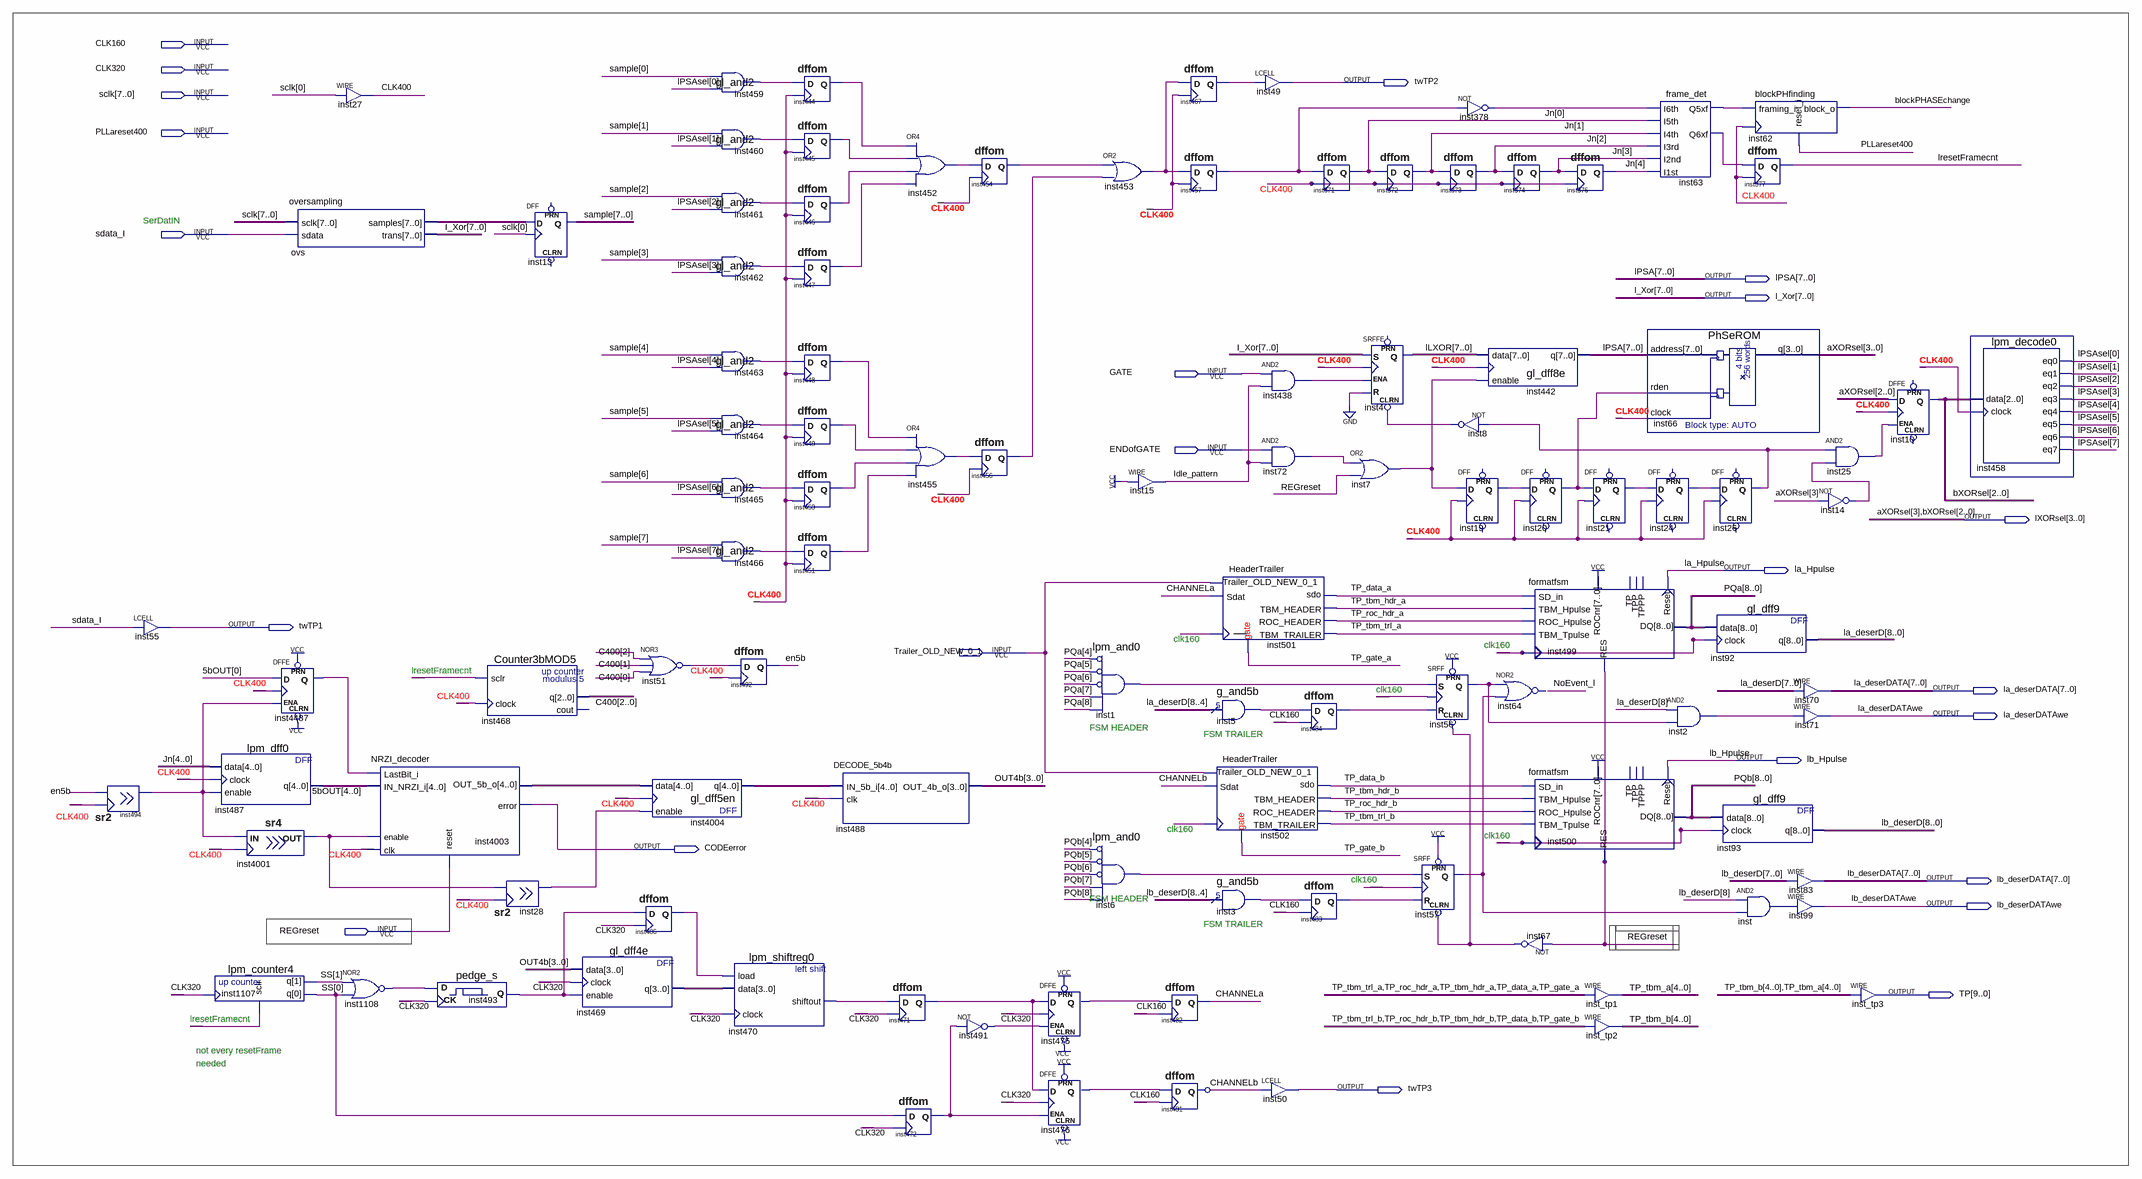
[diagram p0: schematic sheet]
// Quartus schematic deser400_PSI.bdf as structural Verilog: 104 symbols, 23 pins
module deser400_PSI (
  input  CLK160,
  input  CLK320,
  input  [7:0] sclk,
  input  PLLareset400,
  input  sdata_I,
  input  GATE,
  input  ENDofGATE,
  input  Trailer_OLD_NEW_0_1,
  input  REGreset,
  output twTP2,
  output [7:0] lPSA,
  output [7:0] l_Xor,
  output [3:0] lXORsel,
  output la_Hpulse,
  output twTP1,
  output [7:0] la_deserDATA,
  output la_deserDATAwe,
  output lb_Hpulse,
  output CODEerror,
  output [7:0] lb_deserDATA,
  output lb_deserDATAwe,
  output [9:0] TP,
  output twTP3
);

  wire blockPHASEchange, CHANNELa, CHANNELb, CLK400, en5b, Idle_pattern, inst1_result, inst2_out,
       inst3_result, inst5_result, inst6_result, inst7_out, inst8_out, inst14_out, inst19_q, inst20_q,
       inst21_q, inst24_q, inst25_out, inst26_q, inst28_out, inst51_out, inst56_q, inst57_q, inst63_q5xf,
       inst63_q6xf, inst67_out, inst72_out, inst378_out, inst438_out, inst444_q, inst445_q, inst446_q,
       inst447_q, inst448_q, inst449_q, inst450_q, inst451_q, inst452_out, inst453_out, inst454_q,
       inst455_out, inst456_q, inst457_q, inst459_result, inst460_result, inst461_result, inst462_result,
       inst463_result, inst464_result, inst465_result, inst466_result, inst467_q, inst470_shiftout,
       inst471_q, inst472_q, inst475_q, inst476_q, inst481_q, inst483_q, inst484_q, inst486_q, inst491_out,
       inst493_q, inst494_out, inst1108_out, inst4001_out, inst4487_q, inst_out, lresetFramecnt, TP_data_a,
       TP_data_b, TP_gate_a, TP_gate_b, TP_roc_hdr_a, TP_roc_hdr_b, TP_tbm_hdr_a, TP_tbm_hdr_b, TP_tbm_trl_a,
       TP_tbm_trl_b;
  wire [1:0] SS;
  wire [2:0] aXORsel, C400;
  wire [3:0] inst469_q, OUT4b;
  wire [4:0] \5bOUT , inst4003_out_5b_o, inst4004_q, Jn, TP_tbm_a, TP_tbm_b;
  wire [7:0] I_Xor, lLXOR, lPSAsel, ovs_samples, sample;
  wire [8:0] la_deserD, lb_deserD, PQa, PQb;

  sr2 inst494 (.CLK(CLK400), .IN(en5b), .OUT(inst494_out));
  LCELL inst55 (.IN(sdata_I), .OUT(twTP1));
  lpm_dff0 inst487 (.data(Jn), .clock(CLK400), .enable(inst494_out), .q(\5bOUT ));
  sr4 inst4001 (.IN(inst494_out), .CLK(CLK400), .OUT(inst4001_out));
  lpm_counter4 inst1107 (.sclr(lresetFramecnt), .clock(CLK320), .q(SS));
  oversampling ovs (.sclk(sclk), .sdata(sdata_I), .samples(ovs_samples), .trans(I_Xor));
  DFFE inst4487 (.PRN(1'b1), .CLRN(1'b1), .D(\5bOUT [0]), .CLK(CLK400), .ENA(inst494_out), .Q(inst4487_q));
  assign CLK400 = sclk[0];  // WIRE inst27
  nor inst1108 (inst1108_out, SS[1], SS[0]);
  NRZI_decoder inst4003 (
    .clk(CLK400), .reset(REGreset), .enable(inst4001_out), .IN_NRZI_i(\5bOUT ), .LastBit_i(inst4487_q),
    .OUT_5b_o(inst4003_out_5b_o), .error(CODEerror));
  pedge_s inst493 (.D(inst1108_out), .CK(CLK320), .Q(inst493_q));
  Counter3bMOD5 inst468 (.sclr(lresetFramecnt), .clock(CLK400), .q(C400));  // open: cout
  sr2 inst28 (.CLK(CLK400), .IN(inst4001_out), .OUT(inst28_out));
  DFF inst13[7:0] (.CLK(sclk[0]), .D(ovs_samples), .Q(sample));  // open: CLRN, PRN
  gl_dff4e inst469 (.data(OUT4b), .clock(CLK320), .enable(inst493_q), .q(inst469_q));
  nor inst51 (inst51_out, C400[2], C400[1], C400[0]);
  gl_dff5en inst4004 (.data(inst4003_out_5b_o), .enable(inst28_out), .clock(CLK400), .q(inst4004_q));
  dffom inst486 (.D(inst493_q), .CK(CLK320), .Q(inst486_q));
  gl_and2 inst459 (.data0(sample[0]), .data1(lPSAsel[0]), .result(inst459_result));
  gl_and2 inst460 (.data0(sample[1]), .data1(lPSAsel[1]), .result(inst460_result));
  gl_and2 inst461 (.data0(sample[2]), .data1(lPSAsel[2]), .result(inst461_result));
  gl_and2 inst462 (.data0(sample[3]), .data1(lPSAsel[3]), .result(inst462_result));
  gl_and2 inst463 (.data0(sample[4]), .data1(lPSAsel[4]), .result(inst463_result));
  gl_and2 inst464 (.data0(sample[5]), .data1(lPSAsel[5]), .result(inst464_result));
  gl_and2 inst465 (.data0(sample[6]), .data1(lPSAsel[6]), .result(inst465_result));
  gl_and2 inst466 (.data0(sample[7]), .data1(lPSAsel[7]), .result(inst466_result));
  dffom inst492 (.D(inst51_out), .CK(CLK400), .Q(en5b));
  lpm_shiftreg0 inst470 (.load(inst486_q), .data(inst469_q), .clock(CLK320), .shiftout(inst470_shiftout));
  dffom inst444 (.D(inst459_result), .CK(CLK400), .Q(inst444_q));
  dffom inst445 (.D(inst460_result), .CK(CLK400), .Q(inst445_q));
  dffom inst446 (.D(inst461_result), .CK(CLK400), .Q(inst446_q));
  dffom inst447 (.D(inst462_result), .CK(CLK400), .Q(inst447_q));
  dffom inst448 (.D(inst463_result), .CK(CLK400), .Q(inst448_q));
  dffom inst449 (.D(inst464_result), .CK(CLK400), .Q(inst449_q));
  dffom inst450 (.D(inst465_result), .CK(CLK400), .Q(inst450_q));
  dffom inst451 (.D(inst466_result), .CK(CLK400), .Q(inst451_q));
  DECODE_5b4b inst488 (.IN_5b_i(inst4004_q), .clk(CLK400), .OUT_4b_o(OUT4b));
  or inst452 (inst452_out, inst444_q, inst445_q, inst446_q, inst447_q);
  or inst455 (inst455_out, inst448_q, inst449_q, inst450_q, inst451_q);
  dffom inst471 (.D(inst470_shiftout), .CK(CLK320), .Q(inst471_q));
  dffom inst472 (.D(SS[0]), .CK(CLK320), .Q(inst472_q));
  not inst491 (inst491_out, inst472_q);
  dffom inst454 (.D(inst452_out), .CK(CLK400), .Q(inst454_q));
  dffom inst456 (.D(inst455_out), .CK(CLK400), .Q(inst456_q));
  DFFE inst475 (.PRN(1'b1), .CLRN(1'b1), .D(inst471_q), .CLK(CLK320), .ENA(inst491_out), .Q(inst475_q));
  DFFE inst476 (.PRN(1'b1), .CLRN(1'b1), .D(inst471_q), .CLK(CLK320), .ENA(inst472_q), .Q(inst476_q));
  or inst453 (inst453_out, inst454_q, inst456_q);
  lpm_and0 inst1 (
    .data0(~PQa[4]), .data1(~PQa[5]), .data2(~PQa[6]), .data3(PQa[7]), .data4(PQa[8]), .result(inst1_result));
  lpm_and0 inst6 (
    .data0(~PQb[4]), .data1(~PQb[5]), .data2(~PQb[6]), .data3(PQb[7]), .data4(PQb[8]), .result(inst6_result));
  assign Idle_pattern = 1'b1;  // WIRE inst15
  dffom inst482 (.D(inst475_q), .CK(CLK160), .Q(CHANNELa));
  dffom inst481 (.D(inst476_q), .CK(CLK160), .Q(inst481_q));
  not inst481_Q_inverted (CHANNELb, inst481_q);
  dffom inst467 (.D(inst453_out), .CK(CLK400), .Q(inst467_q));
  dffom inst457 (.D(inst453_out), .CK(CLK400), .Q(inst457_q));
  HeaderTrailer inst501 (
    .Sdat(CHANNELa), .CLK(CLK160), .Trailer_OLD_NEW_0_1(Trailer_OLD_NEW_0_1), .TBM_HEADER(TP_tbm_hdr_a),
    .ROC_HEADER(TP_roc_hdr_a), .TBM_TRAILER(TP_tbm_trl_a), .sdo(TP_data_a), .gate(TP_gate_a));
  g_and5b inst5 (.data(la_deserD[8:4]), .result(inst5_result));
  HeaderTrailer inst502 (
    .Sdat(CHANNELb), .CLK(CLK160), .Trailer_OLD_NEW_0_1(Trailer_OLD_NEW_0_1), .TBM_HEADER(TP_tbm_hdr_b),
    .ROC_HEADER(TP_roc_hdr_b), .TBM_TRAILER(TP_tbm_trl_b), .sdo(TP_data_b), .gate(TP_gate_b));
  g_and5b inst3 (.data(lb_deserD[8:4]), .result(inst3_result));
  LCELL inst49 (.IN(inst467_q), .OUT(twTP2));
  and inst438 (inst438_out, GATE, Idle_pattern);
  and inst72 (inst72_out, ENDofGATE, Idle_pattern);
  LCELL inst50 (.IN(CHANNELb), .OUT(twTP3));
  dffom inst371 (.D(inst457_q), .CK(CLK400), .Q(Jn[0]));
  dffom inst484 (.D(inst5_result), .CK(CLK160), .Q(inst484_q));
  dffom inst483 (.D(inst3_result), .CK(CLK160), .Q(inst483_q));
  SRFFE inst4[7:0] (.S(I_Xor), .CLK(CLK400), .CLRN(inst8_out), .R(1'b0), .ENA(inst438_out), .Q(lLXOR));  // open: PRN
  or inst7 (inst7_out, inst72_out, REGreset);
  dffom inst372 (.D(Jn[0]), .CK(CLK400), .Q(Jn[1]));
  SRFF inst57 (.PRN(1'b1), .CLRN(inst67_out), .S(inst6_result), .R(inst483_q), .CLK(CLK160), .Q(inst57_q));
  not inst378 (inst378_out, inst457_q);
  dffom inst373 (.D(Jn[1]), .CK(CLK400), .Q(Jn[2]));
  not inst8 (inst8_out, inst26_q);
  DFF inst19 (.CLK(CLK400), .D(inst7_out), .Q(inst19_q));  // open: CLRN, PRN
  SRFF inst56 (.PRN(1'b1), .CLRN(inst67_out), .S(inst1_result), .R(inst484_q), .CLK(CLK160), .Q(inst56_q));
  dffom inst374 (.D(Jn[2]), .CK(CLK400), .Q(Jn[3]));
  gl_dff8e inst442 (.data(lLXOR), .enable(inst7_out), .clock(CLK400), .q(lPSA));
  // NOR2 inst64 has open pins: IN1=inst56_q, IN2=inst57_q, OUT=open
  not inst67 (inst67_out, REGreset);
  dffom inst376 (.D(Jn[3]), .CK(CLK400), .Q(Jn[4]));
  DFF inst20 (.CLK(CLK400), .D(inst19_q), .Q(inst20_q));  // open: CLRN, PRN
  formatfsm inst499 (
    .TBM_Hpulse(TP_tbm_hdr_a), .ROC_Hpulse(TP_roc_hdr_a), .TBM_Tpulse(TP_tbm_trl_a), .SD_in(TP_data_a),
    .RES(REGreset), .ROCnr({8{1'b1}}), .CLK160(CLK160), .DQ(PQa), .Reset(la_Hpulse));  // open: TPPP, TPP, TP
  formatfsm inst500 (
    .TBM_Hpulse(TP_tbm_hdr_b), .ROC_Hpulse(TP_roc_hdr_b), .TBM_Tpulse(TP_tbm_trl_b), .SD_in(TP_data_b),
    .RES(REGreset), .ROCnr({8{1'b1}}), .CLK160(CLK160), .DQ(PQb), .Reset(lb_Hpulse));  // open: TPPP, TPP, TP
  DFF inst21 (.CLK(CLK400), .D(inst20_q), .Q(inst21_q));  // open: CLRN, PRN
  assign TP_tbm_a = {TP_tbm_trl_a, TP_roc_hdr_a, TP_tbm_hdr_a, TP_data_a, TP_gate_a};  // WIRE inst_tp1
  assign TP_tbm_b = {TP_tbm_trl_b, TP_roc_hdr_b, TP_tbm_hdr_b, TP_data_b, TP_gate_b};  // WIRE inst_tp2
  frame_det inst63 (
    .I1st(Jn[4]), .I2nd(Jn[3]), .I3rd(Jn[2]), .I4th(Jn[1]), .I5th(Jn[0]), .I6th(inst378_out),
    .Q5xf(inst63_q5xf), .Q6xf(inst63_q6xf));
  PhSeROM inst66 (.address(lPSA), .rden(inst20_q), .clock(CLK400), .q({lXORsel[3], aXORsel}));
  DFF inst24 (.CLK(CLK400), .D(inst21_q), .Q(inst24_q));  // open: CLRN, PRN
  and inst2 (inst2_out, la_deserD[8], inst56_q);
  DFF inst26 (.CLK(CLK400), .D(inst24_q), .Q(inst26_q));  // open: CLRN, PRN
  gl_dff9 inst92 (.data(PQa), .clock(CLK160), .q(la_deserD));
  gl_dff9 inst93 (.data(PQb), .clock(CLK160), .q(lb_deserD));
  blockPHfinding inst62 (.reset_i(PLLareset400), .framing_i(inst63_q5xf), .clk_i(CLK400), .block_o(blockPHASEchange));
  dffom inst377 (.D(inst63_q6xf), .CK(CLK400), .Q(lresetFramecnt));
  and inst (inst_out, lb_deserD[8], inst57_q);
  not inst14 (inst14_out, lXORsel[3]);
  assign la_deserDATA = la_deserD[7:0];  // WIRE inst70
  assign la_deserDATAwe = inst2_out;  // WIRE inst71
  assign lb_deserDATA = lb_deserD[7:0];  // WIRE inst83
  assign lb_deserDATAwe = inst_out;  // WIRE inst99
  and inst25 (inst25_out, inst26_q, inst14_out);
  assign TP = {TP_tbm_b, TP_tbm_a};  // WIRE inst_tp3
  DFFE inst10[2:0] (.D(aXORsel), .CLK(CLK400), .ENA(inst25_out), .Q(lXORsel[2:0]));  // open: PRN, CLRN
  lpm_decode0 inst458 (
    .data(lXORsel[2:0]), .clock(CLK400), .eq0(lPSAsel[0]), .eq1(lPSAsel[1]), .eq2(lPSAsel[2]),
    .eq3(lPSAsel[3]), .eq4(lPSAsel[4]), .eq5(lPSAsel[5]), .eq6(lPSAsel[6]), .eq7(lPSAsel[7]));

  // Other names for the same wires on the sheet: aXORsel[3] = lXORsel[3]; bXORsel[2:0] = lXORsel[2:0]

  // Notes on the sheet:
  //   SerDatIN
  //   FSM HEADER
  //   FSM TRAILER
  //   FSM HEADER
  //   FSM TRAILER
  //   not every resetFrame
  //   needed
endmodule
